# Altium schematic sheet Power.SchDoc
size A4; SheetNumber: 1; SheetTotal: 5
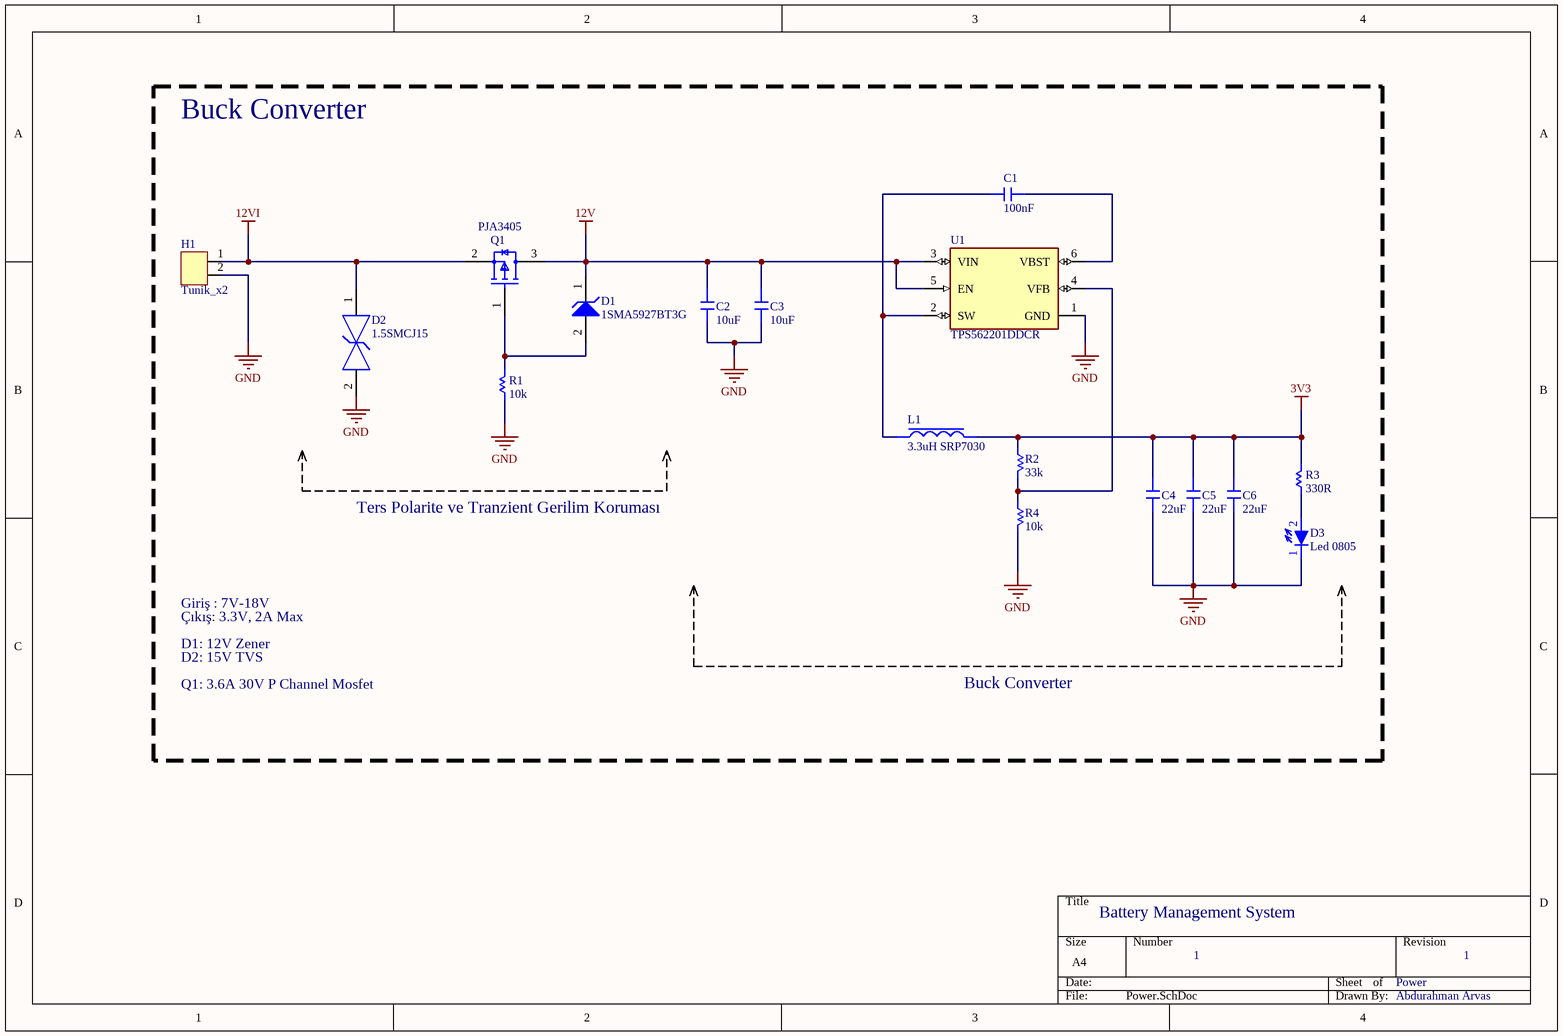
[diagram p0: Power.SchDoc]

## Parts
C1  100nF  [C0805]
C2  10uF  [C0805]
C3  10uF  [C0805]
C4  22uF  [C0805]
C5  22uF  [C0805]
C6  22uF  [C0805]
D1  1SMA5927BT3G  [ONSC-SMA-2-403D-02_F_V]
D2  1.5SMCJ15  [FP-SMC-MFG]
D3  Led 0805  [LED_0805]
H1  Tunik_x2  [2li_Tunik]
L1  3.3uH SRP7030  [Fıxed_Inductor_7.3x7x3]
Q1  PJA3405  [FP-SOT23-MFG]
R1  10k  [R0805]
R2  33k  [R0805]
R3  330R  [R0805]
R4  10k  [R0805]
U1  TPS562201DDCR  [FP-DDC0006A-IPC_A]

## Nets
3V3: C4.2 C5.2 C6.2 L1.2 R2.1 R3.2
12V: C2.2 C3.2 D1.1(K) Q1.3(D) U1.3(VIN) U1.5(EN)
12VI: D2.1 H1.1 Q1.2(S)
GND: C2.1 C3.1 C4.1 C5.1 C6.1 D2.2 D3.1(Cathode) H1.2 R1.1 R4.2 U1.1(GND)
NetC1_1: C1.1 U1.6(VBST)
NetC1_2: C1.2 L1.1 U1.2(SW)
NetD1_2: D1.2(A) Q1.1(G) R1.2
NetD3_2: D3.2(Anode) R3.1
NetR2_2: R2.2 R4.1 U1.4(VFB)

## Notes on the sheet
- Buck Converter
- Ters Polarite ve Tranzient Gerilim Koruması
- Giriş : 7V-18V
- Çıkış: 3.3V, 2A Max
- D1: 12V Zener
- D2: 15V TVS
- Q1: 3.6A 30V P Channel Mosfet
- Battery Management System
- 1
- Power
- Abdurahman Arvas

## Library data of the parts
C1-C6 = SMD_Capacitor
D1 = CMP-1060-00103-1: 1.5 W Zener Voltage Regulator, 2-Pin SMA, Pb-Free, Tape and Reel; Manufacturer: On Semiconductor; VZ Typ (V): 12; DatasheetVersion: Rev. 8; Mounting Technology: Surface Mount; RoHS: Pb-Free; Packing: Tape and Reel; ComponentLink2Description: Datasheet; ComponentLink1URL: http://www.onsemi.com/; PackageDescription: 2-Pin Small Molded Package, J-Bend Lead, Body 2.605 x 4.315 mm; PackageReference: SMA-2-403D-02_F; PartNumber: 1SMA5927BT3G; ComponentLink3URL: http://www.onsemi.com/pub_link/Collateral/1SMA5913BT3-D.PDF; ComponentLink1Description: Manufacturer URL; ComponentLink2URL: http://www.onsemi.com/pub_link/Collateral/1SMA5913BT3-D.PDF; PackageVersion: Rev. F, 11/2008; ComponentLink3Description: Package Specification
D2 = CMP-12225-000018-1: TVS DIODE 12V 19.9V SMC; Manufacturer: STMicroelectronics; Manufacturer Part Number: SMC30J12CA; Peak Pulse Power: 3000W; Number Of Channels: 1; Standoff Height: 0.05mm; Breakdown Voltage: 13.3V; Peak Pulse Current: 151A; Direction: Bidirectional; Max Junction Temp: +175°C; Temperature Range Low: -55°C; Package: SMC; Temperature Range High: +175°C; ComponentLink2Description: Datasheet; Temperature: -55°C to +175°C; Digikey Description: TVS DIODE 12V 19.9V SMC; Device Class L3: unset; Category: Diode; Reverse Standoff Voltage: 12V; Height: 2.65mm; Device Class L1: Circuit Protection; ComponentLink2URL: https://www.st.com/resource/en/datasheet/smc30j.pdf; Device Class L2: TVS Diodes; Automotive: No; Lead Free: Yes; Clamping Voltage: 19.9V; RoHS: TRUE; Octopart: https://octopart.com/smc30j12ca-stmicroelectronics-21709983
D3 = Led 0805: Light Emitting Diode with 0805 Footprint.
H1 = 2Li_Tunik: Value: 2 pin; Datasheet: https://cdn.ozdisan.com/ETicaret_Dosya/34800_4832773.pdf; Buy Link: https://ozdisan.com/konnektor-ve-baglanti-elemanlari/konnektor-cesitleri/pcb-konnektorler/TMK2002
L1 = Fixed_Inductor: Fixed Inductor
Q1 = CMP-12801-000074-1: MOSFET P-CH 60V 0.9A SOT23-3; Current Rating: -1.1A; Threshold Voltage: -3V; Gate to Source Voltage (Vgs): 20V; Number of Elements: 1; On-State Resistance: 600mR; Power Dissipation: 806mW; Element Configuration: Single; Drain to Source Voltage (Vdss): -60V; Input Capacitance: 219pF; Continuous Drain Current (ID): 1.1A; Max Power Dissipation: 625mW; Turn-On Delay Time: 1.6ns; Rise Time: 2.2ns; Rds On Max: 400mR; Turn-Off Delay Time: 11.2ns; Fall Time: 5.7ns; Min Operating Temperature: -55°C; Width: 1.4mm; Package Quantity: 3000; Case/Package: SOT-23; Lead Free: Lead Free; Packaging: Tape and Reel; Mount: Surface Mount; Height: 1.02mm; Length: 3.04mm; Weight: 0.000282oz; Drain to Source Resistance: 600mR; Contact Plating: Tin; Max Operating Temperature: 150°C; Radiation Hardening: No; REACH SVHC: No SVHC; Number of Pins: 3; Voltage Rating (DC): -60V; Number of Channels: 1
R1-R4 = SMD Resistor: SMD Chip Resistor
U1 = CMP-04918-000361-1: IC REG BUCK ADJ 2A TSOT23-6; Switching Frequency: 580kHz; Max Input Voltage: 17V; Number of Outputs: 1; Output Voltage: 7V; Output Type: Adjustable; Quiescent Current: 400uA; Min Input Voltage: 4.5V; Mount: Surface Mount; Max Operating Temperature: 125°C; Lead Free: Lead Free; Operating Supply Voltage: 17V; Number of Pins: 6; RoHS Compliant: Yes; Contact Plating: Tin; Min Operating Temperature: -40°C; Case/Package: SOT; Max Output Current: 2A